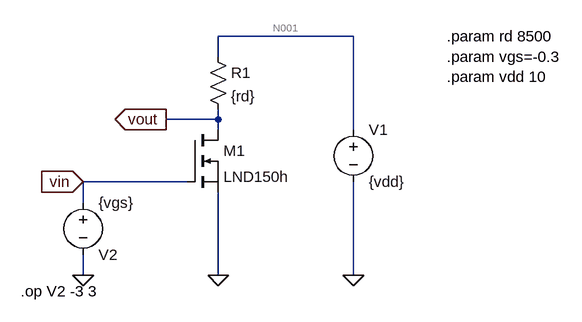
[diagram p0: schematic Draft3.asc]
Draft3.asc, the LTspice schematic file:
Version 4
SHEET 1 880 680
WIRE 400 -32 192 -32
WIRE 192 0 192 -32
WIRE 192 96 192 80
WIRE 192 96 112 96
WIRE 192 112 192 96
WIRE 400 112 400 -32
WIRE 144 192 -16 192
WIRE -16 224 -16 192
WIRE -16 336 -16 304
WIRE 192 336 192 208
WIRE 400 336 400 192
FLAG -16 336 0
FLAG 192 336 0
FLAG 400 336 0
FLAG 112 96 vout
IOPIN 112 96 Out
FLAG -16 192 vin
IOPIN -16 192 In
DATAFLAG 192 240 ""
DATAFLAG 192 96 ""
DATAFLAG 112 192 ""
SYMBOL nmos 144 112 R0
SYMATTR InstName M1
SYMATTR Value LND150h
SYMBOL voltage 400 96 R0
WINDOW 123 0 0 Left 0
WINDOW 39 0 0 Left 0
SYMATTR InstName V1
SYMATTR Value {vdd}
SYMBOL voltage -16 208 R0
WINDOW 0 24 96 Left 2
WINDOW 3 24 16 Left 2
WINDOW 123 0 0 Left 0
WINDOW 39 0 0 Left 0
SYMATTR InstName V2
SYMATTR Value {vgs}
SYMBOL res 176 -16 R0
SYMATTR InstName R1
SYMATTR Value {rd}
TEXT 544 -32 Left 2 !.param rd 8500\n.param vgs=-0.3\n.param vdd 10
TEXT -112 360 Left 2 !.op V2 -3 3

The netlist it stands for:
* Draft3.asc
M1 vout vin 0 0 LND150h
V1 N001 0 {vdd}
V2 vin 0 {vgs}
R1 N001 vout {rd}
.model NMOS NMOS
.model PMOS PMOS
.lib standard.mos
.param rd 8500
.param vgs=-0.3
.param vdd 10
.op V2 -3 3
.backanno
.end

* Results of the author's LTspice run, read from the files saved beside the schematic
* Operating Point:
*   V(vout) = 1.103 V
*   V(vin) = -300 mV
*   V(n001) = 10 V
*   Id(M1) = 1.047 mA
*   Ig(M1) = -3.976 pA
*   Is(M1) = -1.047 mA
*   I(R1) = 1.047 mA
*   I(V1) = -1.047 mA
*   I(V2) = 0 A